# EAGLE design mpr-8x-mux (EAGLE 7.6.0)
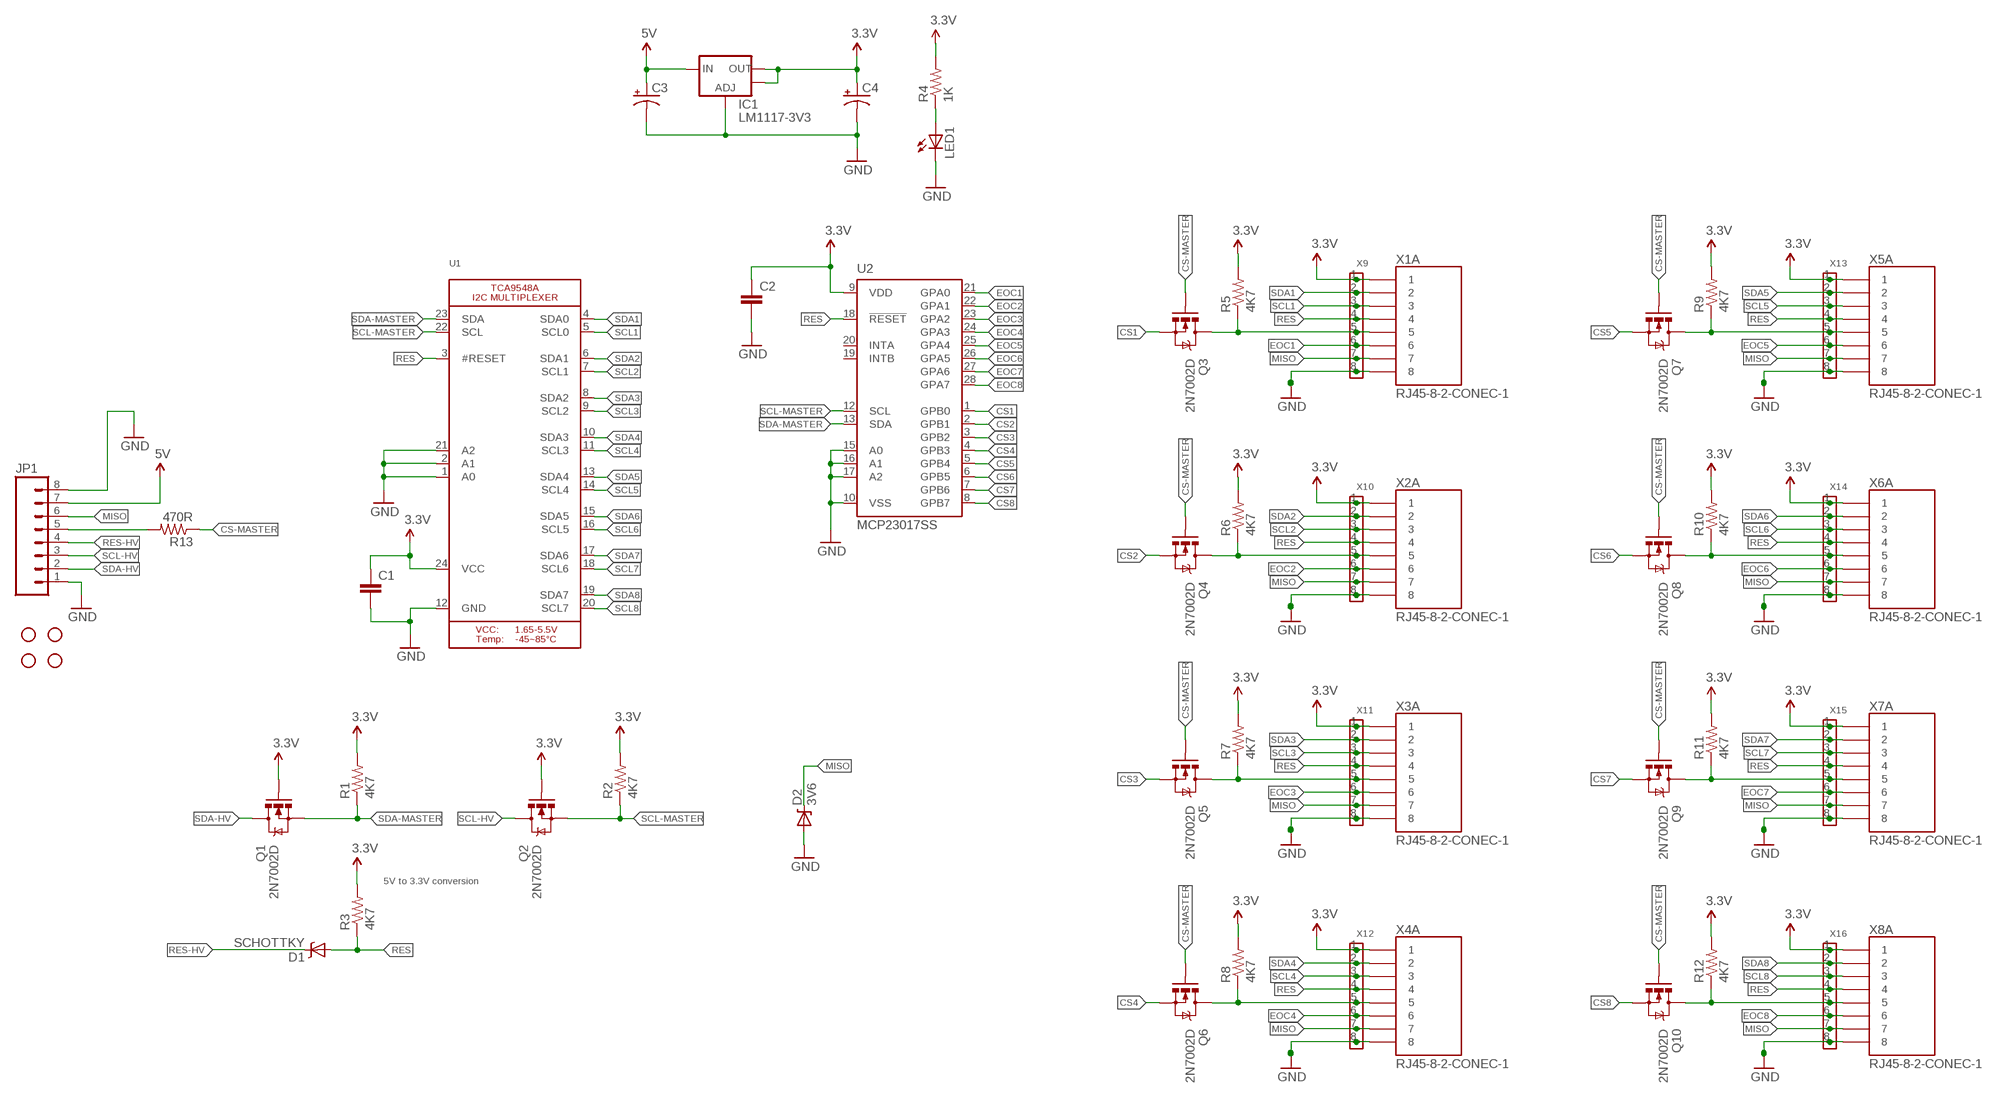
[diagram p0: schematic, sheet 1]

## Parts
C1  CAP0805  [0805]
C2  CAP0805  [0805]
C3  CAP_POL1206-KIT  [EIA3216-KIT]
C4  CAP_POL1206-KIT  [EIA3216-KIT]
D1  SCHOTTKY  DIODE-SCHOTTKYSOD  [SOD-323]
D2  3V6  DIODE-ZENERSOD  [SOD-323]
IC1  LM1117-3V3  V_REG_LM1117SOT223  [SOT223]
JP1  M081X08  [1X08]
JP2  STAND-OFF  [STAND-OFF]
JP3  STAND-OFF  [STAND-OFF]
JP4  STAND-OFF  [STAND-OFF]
JP5  STAND-OFF  [STAND-OFF]
LED1  LED0603  [LED-0603]
Q1  2N7002D  MOSFET-NCHANNELSMD  [SOT23-3]
Q2  2N7002D  MOSFET-NCHANNELSMD  [SOT23-3]
Q3  2N7002D  MOSFET-NCHANNELSMD  [SOT23-3]
Q4  2N7002D  MOSFET-NCHANNELSMD  [SOT23-3]
Q5  2N7002D  MOSFET-NCHANNELSMD  [SOT23-3]
Q6  2N7002D  MOSFET-NCHANNELSMD  [SOT23-3]
Q7  2N7002D  MOSFET-NCHANNELSMD  [SOT23-3]
Q8  2N7002D  MOSFET-NCHANNELSMD  [SOT23-3]
Q9  2N7002D  MOSFET-NCHANNELSMD  [SOT23-3]
Q10  2N7002D  MOSFET-NCHANNELSMD  [SOT23-3]
R1  4K7  RESISTOR0805-RES  [0805]
R2  4K7  RESISTOR0805-RES  [0805]
R3  4K7  RESISTOR0805-RES  [0805]
R4  1K  RESISTOR0805-RES  [0805]
R5  4K7  RESISTOR0805-RES  [0805]
R6  4K7  RESISTOR0805-RES  [0805]
R7  4K7  RESISTOR0805-RES  [0805]
R8  4K7  RESISTOR0805-RES  [0805]
R9  4K7  RESISTOR0805-RES  [0805]
R10  4K7  RESISTOR0805-RES  [0805]
R11  4K7  RESISTOR0805-RES  [0805]
R12  4K7  RESISTOR0805-RES  [0805]
R13  470R  RESISTOR0805-RES  [0805]
U1  TCA9548A  [TSSOP24]
U2  MCP23017SS  [SSOP28]
X1  RJ45-8-2-CONEC-1  [CONEC-33TS3004ST-88001]
X2  RJ45-8-2-CONEC-1  [CONEC-33TS3004ST-88001]
X3  RJ45-8-2-CONEC-1  [CONEC-33TS3004ST-88001]
X4  RJ45-8-2-CONEC-1  [CONEC-33TS3004ST-88001]
X5  RJ45-8-2-CONEC-1  [CONEC-33TS3004ST-88001]
X6  RJ45-8-2-CONEC-1  [CONEC-33TS3004ST-88001]
X7  RJ45-8-2-CONEC-1  [CONEC-33TS3004ST-88001]
X8  RJ45-8-2-CONEC-1  [CONEC-33TS3004ST-88001]
X9  TP-GROUP-X8-2X04  [2X4]
X10  TP-GROUP-X8-2X04  [2X4]
X11  TP-GROUP-X8-2X04  [2X4]
X12  TP-GROUP-X8-2X04  [2X4]
X13  TP-GROUP-X8-2X04  [2X4]
X14  TP-GROUP-X8-2X04  [2X4]
X15  TP-GROUP-X8-2X04  [2X4]
X16  TP-GROUP-X8-2X04  [2X4]

## Nets
3.3V: C1.1 C2.1 C4.A(+) IC1.2(OUT) IC1.4(OUT) Q1.1(G) Q2.1(G) R1.2 R2.2 R3.2 R4.2 R5.2 R6.2 R7.2 R8.2 R9.2 R10.2 R11.2 R12.2 U1.24(VCC) U2.9(VDD) X1.1 X2.1 X3.1 X4.1 X5.1 X6.1 X7.1 X8.1 X9.1 X10.1 X11.1 X12.1 X13.1 X14.1 X15.1 X16.1
5V: C3.A(+) IC1.3(IN) JP1.7
CS1: Q3.2(S) U2.1(GPB0)
CS2: Q4.2(S) U2.2(GPB1)
CS3: Q5.2(S) U2.3(GPB2)
CS4: Q6.2(S) U2.4(GPB3)
CS5: Q7.2(S) U2.5(GPB4)
CS6: Q8.2(S) U2.6(GPB5)
CS7: Q9.2(S) U2.7(GPB6)
CS8: Q10.2(S) U2.8(GPB7)
CS-MASTER: Q3.1(G) Q4.1(G) Q5.1(G) Q6.1(G) Q7.1(G) Q8.1(G) Q9.1(G) Q10.1(G) R13.1
EOC1: U2.21(GPA0) X1.6 X9.6
EOC2: U2.22(GPA1) X2.6 X10.6
EOC3: U2.23(GPA2) X3.6 X11.6
EOC4: U2.24(GPA3) X4.6 X12.6
EOC5: U2.25(GPA4) X5.6 X13.6
EOC6: U2.26(GPA5) X6.6 X14.6
EOC7: U2.27(GPA6) X7.6 X15.6
EOC8: U2.28(GPA7) X8.6 X16.6
GND: C1.2 C2.2 C3.C(-) C4.C(-) D2.2(A) IC1.1(ADJ) JP1.1 JP1.8 LED1.C U1.1(A0) U1.2(A1) U1.12(GND) U1.21(A2) U2.10(VSS) U2.15(A0) U2.16(A1) U2.17(A2) X1.8 X1.M1 X1.M2 X2.8 X2.M1 X2.M2 X3.8 X3.M1 X3.M2 X4.8 X4.M1 X4.M2 X5.8 X5.M1 X5.M2 X6.8 X6.M1 X6.M2 X7.8 X7.M1 X7.M2 X8.8 X8.M1 X8.M2 X9.8 X10.8 X11.8 X12.8 X13.8 X14.8 X15.8 X16.8
MISO: D2.1(C) JP1.6 X1.7 X2.7 X3.7 X4.7 X5.7 X6.7 X7.7 X8.7 X9.7 X10.7 X11.7 X12.7 X13.7 X14.7 X15.7 X16.7
N$1: LED1.A R4.1
N$2: Q7.3(D) R9.1 X5.5 X13.5
N$3: Q8.3(D) R10.1 X6.5 X14.5
N$4: Q9.3(D) R11.1 X7.5 X15.5
N$5: Q10.3(D) R12.1 X8.5 X16.5
N$6: Q6.3(D) R8.1 X4.5 X12.5
N$7: Q5.3(D) R7.1 X3.5 X11.5
N$8: Q4.3(D) R6.1 X2.5 X10.5
N$9: Q3.3(D) R5.1 X1.5 X9.5
N$10: JP1.5 R13.2
RES: D1.2(A) R3.1 U1.3(#RESET) U2.18(!RESET) X1.4 X2.4 X3.4 X4.4 X5.4 X6.4 X7.4 X8.4 X9.4 X10.4 X11.4 X12.4 X13.4 X14.4 X15.4 X16.4
RES-HV: D1.1(C) JP1.4
SCL1: U1.5(SCL0) X1.3 X9.3
SCL2: U1.7(SCL1) X2.3 X10.3
SCL3: U1.9(SCL2) X3.3 X11.3
SCL4: U1.11(SCL3) X4.3 X12.3
SCL5: U1.14(SCL4) X5.3 X13.3
SCL6: U1.16(SCL5) X6.3 X14.3
SCL7: U1.18(SCL6) X7.3 X15.3
SCL8: U1.20(SCL7) X8.3 X16.3
SCL-HV: JP1.3 Q2.3(D)
SCL-MASTER: Q2.2(S) R2.1 U1.22(SCL) U2.12(SCL)
SDA1: U1.4(SDA0) X1.2 X9.2
SDA2: U1.6(SDA1) X2.2 X10.2
SDA3: U1.8(SDA2) X3.2 X11.2
SDA4: U1.10(SDA3) X4.2 X12.2
SDA5: U1.13(SDA4) X5.2 X13.2
SDA6: U1.15(SDA5) X6.2 X14.2
SDA7: U1.17(SDA6) X7.2 X15.2
SDA8: U1.19(SDA7) X8.2 X16.2
SDA-HV: JP1.2 Q1.3(D)
SDA-MASTER: Q1.2(S) R1.1 U1.23(SDA) U2.13(SDA)
Unconnected: U2.19(INTB) U2.20(INTA)

## Notes on the sheet
- 5V to 3.3V conversion

## Library data of the parts
C1 C2 = apollo-ctrl:CAP: Capacitor Standard 0603 ceramic capacitor, and 0.1" leaded capacitor.
C3 C4 = apollo-ctrl:CAP_POL: Capacitor Polarized These are standard SMD and PTH capacitors. Normally 10uF, 47uF, and 100uF in electrolytic and tantalum varieties. Always verify the external diameter of the through hole cap, it varies with capacity, voltage, and manufacturer. The EIA devices should be standard.
D1 = apollo-ctrl:DIODE-SCHOTTKY
D2 = apollo-ctrl:DIODE-ZENER: Zener Diode Production Part - 8199 3.4V Zener Voltage
IC1 = apollo-ctrl:V_REG_LM1117: Voltage Regulator LM1117 Standard adjustable voltage regulator but in SMD form. Spark Fun Electronics SKU : COM-00595
JP1 = apollo-ctrl:M08: Header 8 Standard 8-pin 0.1" header. Use with straight break away headers (SKU : PRT-00116), right angle break away headers (PRT-00553), swiss pins (PRT-00743), machine pins (PRT-00117), and female headers (PRT-00115).
JP2-JP5 = apollo-ctrl:STAND-OFF: Stand Off This is the mechanical footprint for a #4 phillips button head screw. Use the keepout ring to avoid running the screw head into surrounding components. SKU : PRT-00447
LED1 = apollo-ctrl:LED: LEDs Standard schematic elements and footprints for 5mm, 3mm, 1206, and 0603 sized LEDs. 5mm - Spark Fun Electronics SKU : COM-00529 (and others)
Q1-Q10 = apollo-ctrl:MOSFET-NCHANNEL
R1-R13 = apollo-ctrl:RESISTOR: Resistor Basic schematic elements and footprints for 0603, 1206, and PTH resistors.
U1 = apollo-ctrl:TCA9548A: TCA9548A I2C Multiplexer
U2 = apollo-ctrl:MCP23017: http://ww1.microchip.com/downloads/en/DeviceDoc/21952a.pdf Source: http://ww1.microchip.com/downloads/en/DeviceDoc/21952a.pdf; MF: MICROCHIP; MPN: MCP23017-E/SS; OC_FARNELL: 1467674; OC_NEWARK: 31K2960
X1-X8 = apollo-ctrl:RJ45-8-2
X9-X16 = apollo-ctrl:TP-GROUP-X8

## Board
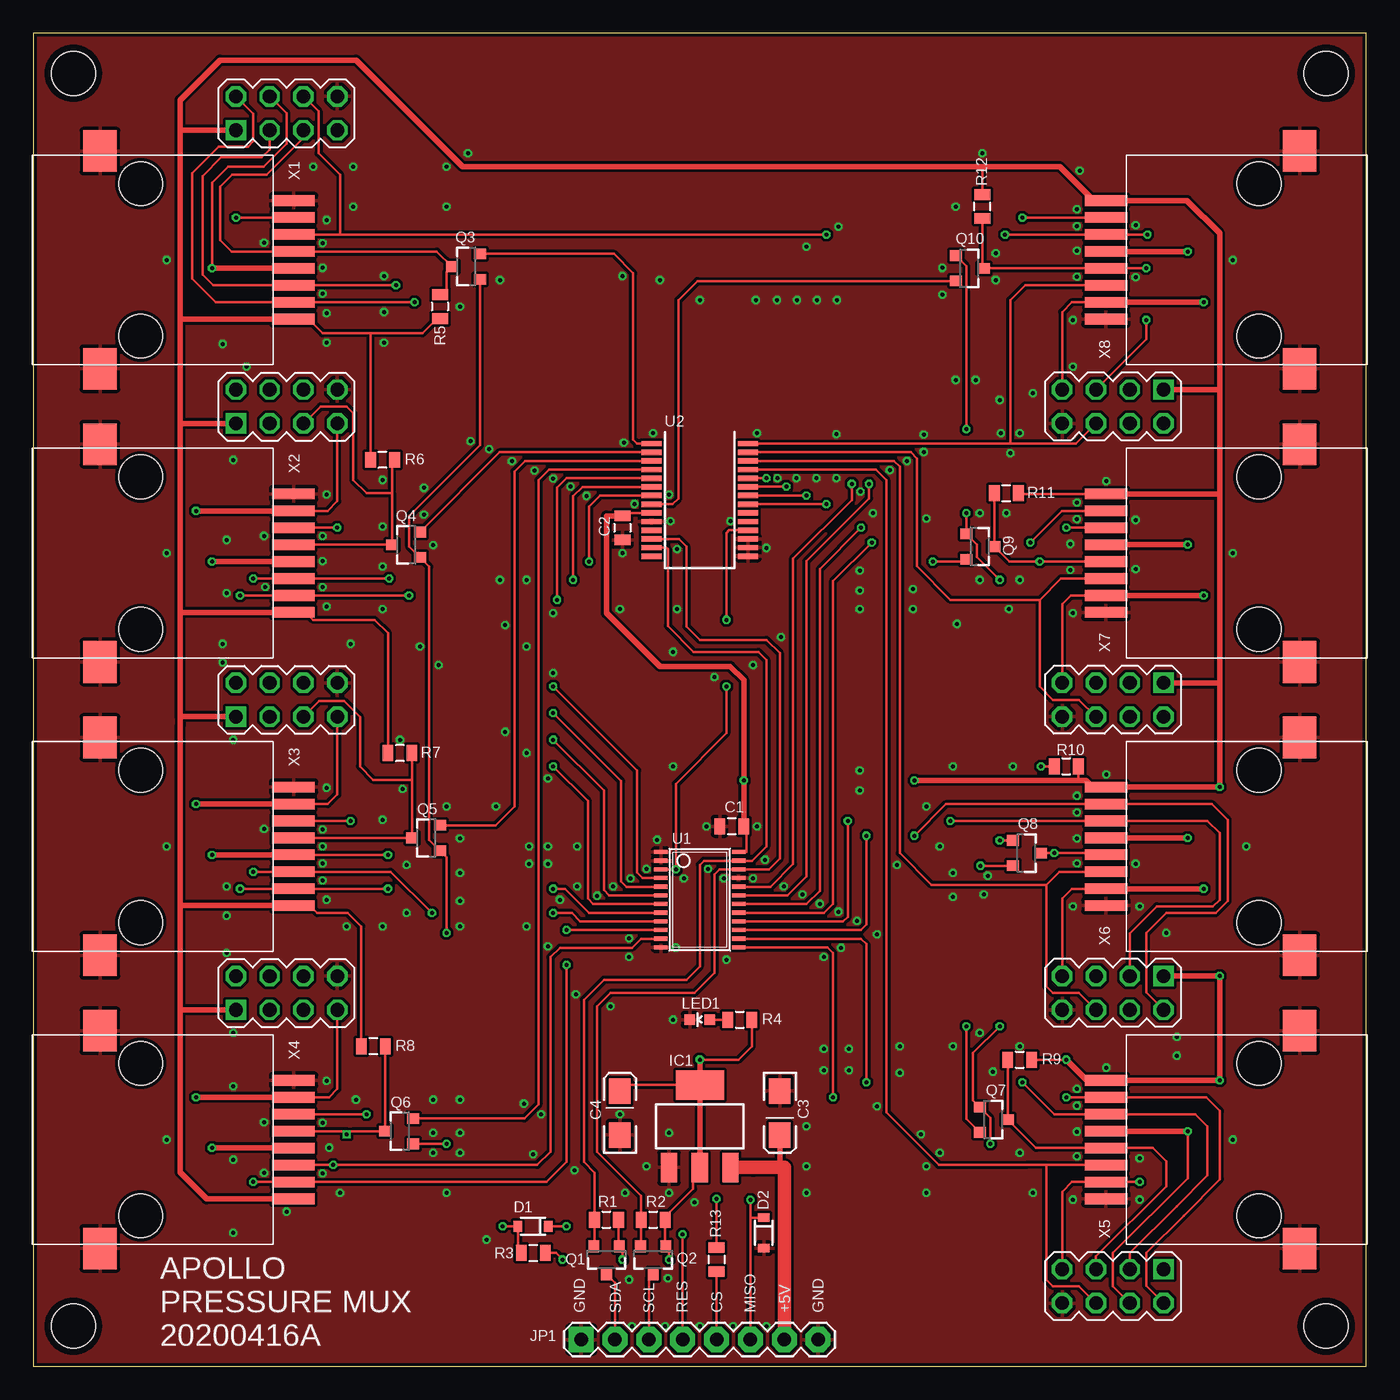
[diagram p1: board, top side]
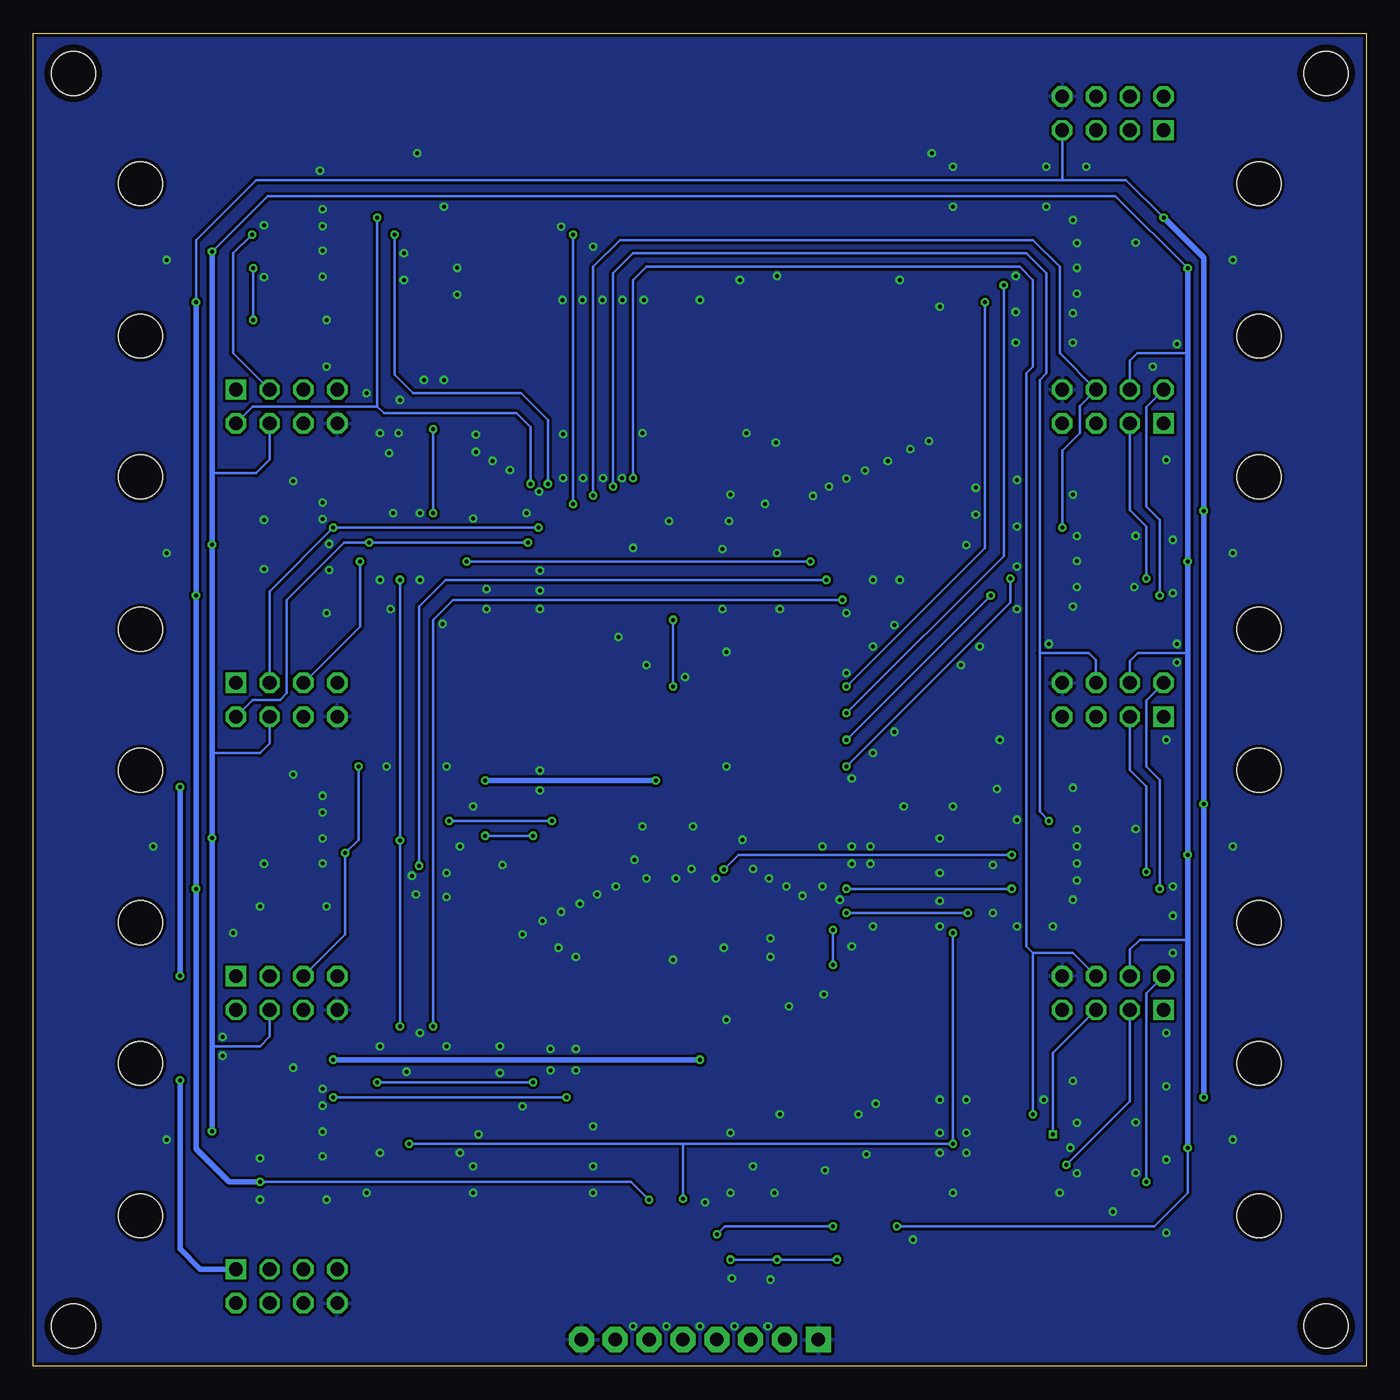
[diagram p2: board, bottom side, seen from below]

Size 100 x 100 mm. Coordinates in mm from the lower left corner, seen from the top.
Outline: 0,0 100,0 100,100 0,100 0,0
Copper layers (1*16): Top 0.035mm / dielectric 1.5mm / Bottom 0.035mm
Design rules "fusion-eagle-rule-tentedvias *": minimum track width 8mil, minimum drill 0.3mm, track to track 8mil, track to pad 8mil, pad to pad 8mil, via to via 8mil, smd to smd 0mil, copper to edge 10mil, drill to drill 10mil, minimum pad ring 10mil, minimum via ring 6mil, stop-mask expansion 2mil, vias tented up to drill 25mil, thermal gap 10mil

### Footprints (pad centres in the part's own frame; a part is rotated, then mirrored left to right if it is on the bottom)
0805 = smd 0.8 x 1.2: 1 -0.9,0; 2 0.9,0
EIA3216-KIT = smd 1.9 x 1.6: A 1.65,0; C -1.65,0
SOD-323 = smd 0.63 x 0.83: 1 -1.15,0; 2 1.15,0
SOT223 = smd 1.219 x 2.235: 1 -2.311,-3.099; 2 0,-3.099; 3 2.311,-3.099 | smd 3.6 x 2.2: 4 0,3.099
1X08 = drill 1.016 pad 1.88 square: 1 0,0 | drill 1.016 pad 1.88 octagon: 2 2.54,0; 3 5.08,0; 4 7.62,0; 5 10.16,0; 6 12.7,0; 7 15.24,0; 8 17.78,0
STAND-OFF = hole 3.302: 0,0
LED-0603 = smd 0.8 x 0.8: A 0,-0.75; C 0,0.75
SOT23-3 = smd 0.8 x 0.9: 1 -0.95,-1; 2 0.95,-1; 3 0,1.1
TSSOP24 = smd 0.305 x 0.991: 1 -3.575,-2.918; 2 -2.925,-2.918; 3 -2.275,-2.918; 4 -1.625,-2.918; 5 -0.975,-2.918; 6 -0.325,-2.918; 7 0.325,-2.918; 8 0.975,-2.918; 9 1.625,-2.918; 10 2.275,-2.918; 11 2.925,-2.918; 12 3.575,-2.918; 13 3.575,2.918; 14 2.925,2.918; 15 2.275,2.918; 16 1.625,2.918; 17 0.975,2.918; 18 0.325,2.918; 19 -0.325,2.918; 20 -0.975,2.918; 21 -1.625,2.918; 22 -2.275,2.918; 23 -2.925,2.918; 24 -3.575,2.918
SSOP28 = smd 0.4 x 1.5: 1 -4.225,-3.625; 2 -3.575,-3.625; 3 -2.925,-3.625; 4 -2.275,-3.625; 5 -1.625,-3.625; 6 -0.975,-3.625; 7 -0.325,-3.625; 8 0.325,-3.625; 9 0.975,-3.625; 10 1.625,-3.625; 11 2.275,-3.625; 12 2.925,-3.625; 13 3.575,-3.625; 14 4.225,-3.625; 15 4.225,3.625; 16 3.575,3.625; 17 2.925,3.625; 18 2.275,3.625; 19 1.625,3.625; 20 0.975,3.625; 21 0.325,3.625; 22 -0.325,3.625; 23 -0.975,3.625; 24 -1.625,3.625; 25 -2.275,3.625; 26 -2.925,3.625; 27 -3.575,3.625; 28 -4.225,3.625
CONEC-33TS3004ST-88001 = smd 0.8 x 3.2: 1 -4.445,-14.52; 2 -3.175,-14.52; 3 -1.905,-14.52; 4 -0.635,-14.52; 5 0.635,-14.52; 6 1.905,-14.52; 7 3.175,-14.52; 8 4.445,-14.52 | smd 3.12 x 2.54: M1 -8.17,0; M2 8.17,0 | hole 3.3: -5.715,-3.05; 5.715,-3.05
2X4 = drill 1.016 square: 1 -3.81,-1.27 | drill 1.016 octagon: 2 -3.81,1.27; 3 -1.27,-1.27; 4 -1.27,1.27; 5 1.27,-1.27; 6 1.27,1.27; 7 3.81,-1.27; 8 3.81,1.27

### Placement (x,y rotation side)
C1  52.4,40.5 180 top
C2  44.2,62.9 270 top
C3  56,19 270 top
C4  44,19 90 top
D1  37.5,10.5 180 top
D2  54.8,10 270 top
IC1  50,18 0 top
JP1  41.1,2 0 top
JP2  3,3 0 top
JP3  97,3 0 top
JP4  3,97 0 top
JP5  97,97 0 top
LED1  50,26 90 top
Q1  43,8 180 top
Q2  46.5,8 180 top
Q3  32.5,82.5 90 top
Q4  28,61.63 90 top
Q5  29.5,39.63 90 top
Q6  27.5,17.64 90 top
Q7  72,18.5 270 top
Q8  74.5,38.5 270 top
Q9  71,61.5 270 top
Q10  70.2,82.36 270 top
R1  43,11 0 top
R2  46.5,11 0 top
R3  37.5,8.5 0 top
R4  53,26 0 top
R5  30.5,79.5 270 top
R6  26.2,68 180 top
R7  27.5,46 180 top
R8  25.5,24 180 top
R9  74,23 0 top
R10  77.5,45 0 top
R11  73,65.5 0 top
R12  71.2,87 90 top
R13  51.26,8 270 top
U1  50,35 270 top
U2  50,65 270 top
X1  5,83 90 top
X2  5,61 90 top
X3  5,39 90 top
X4  5,17 90 top
X5  95,17 270 top
X6  95,39 270 top
X7  95,61 270 top
X8  95,83 270 top
X9  19,94 0 top
X10  19,72 0 top
X11  19,50 0 top
X12  19,28 0 top
X13  81,6 180 top
X14  81,28 180 top
X15  81,50 180 top
X16  81,72 180 top

### Tracks (layer width: path | path; a pad name or v marks a point on that pad's centre or on a via)
3.3V  (via drill 0.3)
  Top 0.203: U2.9 44.2,64.03 C2.1 | U1.24 53.5,38.58 53.5,40.5 | IC1.4 44,21.1 C4.A | IC1.2 49.5,14.9 49.5,13.3 47.4,11.2 R2.2 47.4,9 Q2.1 47.7,9 v47.7,8 | R1.2 43.9,9 Q1.1 44.2,9 v44.2,8 | R3.2 39.2,8.5 v39.7,8 | v50,23 52.9,23 53.9,24 R4.2 | R9.2 v77.5,23 | R10.2 78.4,43.95 78,43.95 | X7.1 73.9,65.44 R11.2 | R12.2 71.2,90 32.2,90 | 11,24 11,25 | 11,46 11,47 | 11,68 11,69.5 | 25.3,77.5 29.2,77.5 30.3,78.6 R5.2 | 25.3,77.5 21.7,77.5 20.64,78.56 X1.1 | 89,73.27 89,74.5 | 89,51.27 89,51 | R8.2 24.6,32.99 23.59,34 21.3,34 20.75,34.55 X3.1 | 11,26.73 11,26.5 | R7.2 26.6,54.99 25.59,56 21,56 20.45,56.55 X2.1 | R6.2 25.3,77.5
  Top 0.406: X3.1 11,34.55 | 11,34.55 11,47 11,48 11,48.73 | 11,48.73 11,56.55 | 11,56.55 11,69.5 11,70.73 | 11,70.73 11,78.56 | 11,78.56 X1.1 | X2.1 11,56.55 | X4.1 13,12.55 11,14.56 11,25 11,26.5 11,34.55 | 89,65.44 89,51 v89,43.45 X6.1 79.45,43.45 78.95,43.95 78,43.95 v66.1,43.95 | 89,65.44 89,74.5 89,85 86.56,87.44 X8.1 79.56,87.44 77,90 32.2,90 24.2,98 14,98 11,95 11,92.73 | X7.1 89,65.44 | C2.1 43,63.8 43,56.5 47,52.5 52.28,52.5 53.3,51.48 v53.3,43.95 C1.1 53.5,40.5 | 11,78.56 11,92.73 | v50,23 IC1.4 IC1.2 | v77.5,23 79.06,21.45 X5.1 v89,21.45 v89,29.27 X14.1 | X16.1 89,73.27 | X15.1 89,51.27 | X12.1 11,26.73 | X9.1 11,92.73 | X10.1 11,70.73 | X11.1 11,48.73
  Bottom 0.203: v47.7,8 v44.2,8 v39.7,8
  Bottom 0.406: v66.1,43.95 v53.3,43.95 | v77.5,23 v50,23 | v89,43.45 v89,29.27 | X13.1 87.48,7.27 89,8.79 v89,21.45
5V
  Top 0.406: C3.A 56,14.9 54,14.9
  Top 1.016: JP1.7 56.34,14.9 54,14.9 IC1.3
CS1
  Top 0.203: U2.1 45.3,69.22 45,69.53 45,82 43.55,83.45 Q3.2
CS2
  Top 0.203: U2.2 34.99,68.58 Q4.2
CS3
  Top 0.203: U2.3 36.9,67.92 36.1,67.12 36.1,42 34.68,40.59 Q5.2
CS4
  Top 0.203: U2.4 38.7,67.28 37.9,66.47 37.9,19.64 36.85,18.59 Q6.2
CS5  (via drill 0.3)
  Top 0.203: U2.5 40,66.62 39.3,65.92 v39.3,57.5 | Q7.2 70,18.55 v70,25.5
  Bottom 0.203: v70,25.5 70,56 68.5,57.5 v39.3,57.5
CS6  (via drill 0.3)
  Top 0.203: U2.6 41.2,65.97 40.5,65.27 v40.5,59 | v71.06,37.55 Q8.2
  Bottom 0.203: v71.06,37.55 71.06,57 69.06,59 v40.5,59
CS7  (via drill 0.3)
  Top 0.203: U2.7 42.52,65.33 41.7,64.51 v41.7,60.37 | v67.48,60.37 70,60.37 Q9.2
  Bottom 0.203: v41.7,60.37 v67.48,60.37
CS8
  Top 0.203: U2.8 47.96,64.67 48.4,65.11 48.4,80 49.82,81.42 Q10.2
CS-MASTER  (via drill 0.3)
  Top 0.203: v72.5,25.5 70.5,23.5 70.5,19.95 Q7.1 71.8,18.65 v71.8,16.68 | v72.5,59 70.8,60.7 70.8,61.65 Q9.1 v70,64 | v70,70.3 70,82.52 Q10.1 | v31,32.5 31,38.19 Q5.1 29.7,39.48 29.7,59.98 Q4.1 28.2,61.48 28.2,63.8 33.5,69.1 Q3.1 | Q8.1 v72.5,39.45 | Q6.1 v31,16.68 | R13.1 v51.26,12.54
  Bottom 0.203: v70,64 v70,70.3 | v31,32.5 v31,16.68 51.26,16.68 | v51.26,12.54 51.26,16.68 | 51.26,16.68 v71.8,16.68 | v72.5,25.5 v72.5,39.45 v72.5,59
EOC1  (via drill 0.3)
  Top 0.203: U2.21 v59.5,64.67 | v59.5,84.91 23,84.91 | 23,84.91 X1.6 | X9.6 21.4,94.14 21.4,91 23,89.4 23,84.91
  Bottom 0.203: v59.5,64.67 v59.5,84.91
EOC2  (via drill 0.3)
  Top 0.203: U2.22 v58,65.33 | v22.8,62.91 X2.6
  Bottom 0.203: v58,65.33 58,82.5 56,84.5 25,84.5 23,82.5 23,76 X10.6 21.5,72.04 21.5,70 22.8,68.7 v22.8,62.91
EOC3  (via drill 0.3)
  Top 0.203: U2.23 53.62,66 v56.5,66 | v23.8,40.91 X3.6
  Bottom 0.203: v56.5,66 56.5,82 55,83.5 25.5,83.5 24,82 24,74.5 24.5,74 24.5,53.5 | 24.5,53.5 24.5,41.6 v23.8,40.91 | X11.6 20.27,52.97 20.8,53.5 24.5,53.5
EOC4  (via drill 0.3)
  Top 0.203: U2.24 v55,66.62 | v25,18.91 X4.6
  Bottom 0.203: v55,66.62 55,81.5 54,82.5 26,82.5 25,81.5 25,75 25.5,74.5 25.5,31.5 25,31 | 25,31 v25,18.91 | X12.6 22,31 25,31
EOC5
  Top 0.203: U2.25 63.23,67.28 64,66.5 64,19.03 67.94,15.1 74.5,15.1 76,15.1 | 76,15.1 X5.6 | X13.6 78.46,6 76.5,6 76,6.5 76,15.1
EOC6
  Top 0.203: U2.26 64.58,67.92 65,67.5 65,38.5 67.39,36.11 76,36.11 | X6.6 76.98,37.09 76,36.11 | X14.6 78.46,28 76.5,28 76,28.5 76,36.11
EOC7
  Top 0.203: U2.27 65.83,68.58 66.3,68.1 66.3,60.02 68.82,57.5 75.5,57.5 | X7.6 77.09,59.09 75.5,57.5 | X15.6 78.46,50 76.5,50 75.5,51 75.5,57.5
EOC8
  Top 0.203: U2.28 73.3,69.22 | 73.3,69.22 73.3,79.98 74.41,81.09 X8.6 | X16.6 78.22,69.22 73.3,69.22
GND  (via drill 0.3)
  other vias: 47.7,13 47.7,17.5 44,18.9 48.2,31.4 50.5,40.5 44.2,61 47.8,63.4 22,86 22,65.4 22,43.4 22,21.4 78,12.5 78,34.5 78,56.5 78,78.5 55.82,66.62 57.25,66.62 58.75,66.62 60.25,66.62 54.3,40.5 48.3,56.8 54.9,38 54,36.6 56.3,36 57.7,35.4 62.05,65.62 59,34.7 60.4,34.1 61.8,33.4 64.25,67.22 51.8,36.6 65.55,67.92 45.1,64.7 52.3,63.4 46,37.3 44.8,36.6 43.5,36 42.3,35.3 44.7,32.1 50.62,37.3 19,11.6 41.5,65.3 40.3,66 39,66.6 37.6,67.2 63,64 35.9,67.9 34.2,68.8 38.6,31.5 38.1,18.9 22.2,16.4 21.7,60.4 21.7,82.4 48.8,36.6 39.5,35 40.8,36 40.8,39 38.6,39 37.2,39 37.2,37.7 38.6,37.7 34.7,42 28,37.6 35,59 37,59 48,53.6 54,52.6 56.1,54.7 55,61.4 62,56.8 62,58.2 62,59.7 66,58.3 67,63.6 77.8,61.7 78.3,39.6 78.3,17.6 54.3,70 72.6,70 74,70 60.4,85.5 78.3,83.7 17.3,84.3 17.3,62.3 17.3,40.3 17.3,18.3 17.3,14.5 83,15.6 82.7,37.7 82.7,59.8 82.7,63.5 82.7,81.7 82.7,85.6 58,84 26.3,79.1 26.3,81.8 66,56.8 73.2,56.8 62,44.7 62,43.2 67,42 68,39 63.3,32.4 61.2,23.8 61.2,22.2 63.3,19.5 36.8,19.7 40.6,14.7 44.4,13 44.9,3 47.4,3 50,3 52.5,3 55,3 48.3,61.3 39,52 39,56.5 46.8,39.5 51.1,51.7 46.5,70 47.7,65.4 60.25,69.92 28,34 26.2,41 23,13 21.7,14.46 21.7,18.27 21.7,36.46 21.7,40.27 21.7,37.73 21.7,39 21.7,58.46 21.7,62.27 21.7,84.27 21.7,80.46 78.3,15.73 78.3,19.55 78.3,20.8 78.3,42.8 78.3,64.8 78.3,86.8 78.3,37.73 77.8,59.73 78.3,81.73 78.3,63.54 80.5,44.4 80.5,22.4 80.5,66.4 78.5,89.7 22,35 22,57 22,79 43.3,27 66.6,17.4 26.2,60 49.6,12.3 47.6,6.6 44.7,6.5 59.3,23.8 59.3,22.2 59.3,30.7 60.6,31.4 78.3,41.55 29.3,63.9 32,17.5 30,17.5 30,16 32,16 46,15 68,16 74,24 67,15 67,13 65,24 65,22 50,80 47,81.5 44.2,81.8 32,79.5 26.3,76.8 22,76.8 26.2,66.5 29.3,65.9 30,61.6 27.5,47 31,42 32,39.6 32,37 32,34.9 32,33 30,20 32,20 31,13 37.5,15.9 74,16 72,22.1 71,25 71.3,35.4 71.6,36.8 69,37 69,35.2 64.8,37.6 69,45 73.5,45 71,59 74,59 69.3,55.7 66.8,68.6 66.8,69.9 69.2,74 70.7,74 78,75 72.2,83.5 72.2,81.5 71.2,91 69.2,87 68.2,82.4 68.2,80.4 60.3,80 55.8,80 57.3,80 58.8,80 54.2,80 44.3,69.3 32.8,69.4 26.2,63 26.2,56.8 29,54 30.4,52.6 35.4,55.6 35.4,47.6 38.6,44.1 37,46 37,54 44,56.8 37,33 69,24 44.7,30.7 40.7,27.9 48,26 52,30.5 58,15 58,13 58,18 34,9.5 73,64 71,64 73.3,68.5 75,73 72.5,72.5 16,75 15,68 14.5,62 14.5,58 17.4,58.46 14.2,54.2 14.2,52.8 14.5,36 14.5,33.8 14.5,31 15,25 15,21 15,15.5 24.2,20 23.5,33 26.2,33 23.8,54.2 27.7,43.3 15,47 14.2,76.7 24,90 21,90 24,87 32.6,91 31,90 31,87 35,81.5 78.3,85.54 85,32.5 83,34.5 85.8,23.3 85.8,24.7 75,13 83,12.5 48,45 15,10 10,17 10,39 10,61 10,83 90,83 90,61 91,39 90,17
  pour Top (isolate 0.203): 0,0 100,0 100,100 0,100
  pour Bottom (isolate 0.203): 0,0 100,0 100,100 0,100
MISO  (via drill 0.3)
  Top 0.203: JP1.6 v53.8,12.48 | 53.8,12.15 v53.8,12.48 | D2.1 53.8,11.15 v53.8,12.48 | X8.7 77.92,79.83 77.19,79.1 X16.7 | X15.7 77.19,57.17 77.85,57.83 X7.7 | X14.7 77.19,35.09 77.92,35.83 X6.7 | v83,13.82 X5.7 77.92,13.82 77.19,13.1 X13.7 | X12.7 22.81,20.79 22.2,20.18 X4.7 | X11.7 22.81,42.89 22.1,42.17 X3.7 | X2.7 22.1,64.17 22.81,64.89 X10.7 | X1.7 v15.2,86.17
  Top 0.406: X4.7 v12.2,20.18 | X3.7 v12.2,42.17 | X2.7 v12.2,64.17 | v87.8,79.83 X8.7 | X6.7 v87.8,35.83 | X7.7 v87.8,57.83
  Bottom 0.203: v53.8,12.48 55.14,13.82 v83,13.82 | v87.8,79.83 87.8,84.5 83.3,89 22.81,89 | 22.81,89 18.02,89 v15.2,86.17 | X9.7 22.81,89
  Bottom 0.406: v12.2,20.18 v12.2,42.17 v12.2,64.17 12.2,83.17 v15.2,86.17 | v87.8,79.83 v87.8,57.83 v87.8,35.83 87.8,16.32 85.3,13.82 v83,13.82
N$1
  Top 0.203: R4.1 LED1.A
N$2
  Top 0.203: R9.1 Q7.3 75.23,16.36 X5.5 83.99,16.36 85,15.36 85,13.5 79.73,8.23 X13.5
N$3  (via drill 0.3)
  Top 0.203: X6.5 80.48,38.5 v76.6,38.5 Q8.3 | R10.1 v75.6,45
  Bottom 0.203: v75.6,45 75.6,39.5 v76.6,38.5 76.6,32.4 X14.5
N$4  (via drill 0.3)
  Top 0.203: R11.1 Q9.3 73.23,60.37 v75.5,60.37 X7.5
  Bottom 0.203: v75.5,60.37 75.5,55.5 X15.5
N$5  (via drill 0.3)
  Top 0.203: R12.1 71.2,82.36 Q10.3 X8.5 v83.5,82.36 | X16.5 83.5,77.04 v83.5,78.5
  Bottom 0.203: v83.5,78.5 v83.5,82.36
N$6  (via drill 0.3)
  Top 0.203: R8.1 Q6.3 24,17.64 23.5,17.64 | 23.5,17.64 X4.5 | v23.5,17.4 23.5,17.64
  Bottom 0.203: X12.5 23.5,23.5 v23.5,17.4
N$7
  Top 0.203: X3.5 Q5.3 28.4,44 | R7.1 28.4,44 | X11.5 21.44,49.9 23.3,49.9 24.5,48.7 24.5,45 25.5,44 28.4,44
N$8
  Top 0.203: 26.9,65.5 Q4.3 X2.5 | X10.5 21.54,72 23.5,72 24,71.5 24,66.5 25,65.5 26.9,65.5 | 26.9,65.5 26.9,68 R6.1
N$9
  Top 0.203: R5.1 31,80.4 31,82.1 Q3.3 30.27,83.64 X1.5 14.87,83.64 14,84.5 14,88.5 14.9,89.4 17.5,89.4 20.27,92.17 X9.5
N$10
  Top 0.203: JP1.5 R13.2
RES  (via drill 0.3)
  Top 0.203: U2.18 52.2,62.73 52,62.52 v52,56 | v52,51 52,47.5 48.2,43.7 v48.2,37.27 U1.3 | v26.6,38.37 X3.4 | R3.1 36.35,8.55 D1.2 v35.22,10.5 | X13.4 81,6 81,8.5 86.6,14.1 v86.6,17.64 | X9.4 19,94 19,91.71 17.29,90 14.6,90 13.4,88.8 v13.4,82.36
  Top 0.406: X5.4 v86.6,17.64 | X7.4 v86.6,61.63 | X6.4 v86.6,39.63 | X4.4 v13.4,16.36 | X2.4 v13.4,60.37 | X8.4 v86.6,83.64 | X3.4 v13.4,38.37 | X1.4 v13.4,82.36
  Bottom 0.203: v26.6,38.37 47.11,38.37 v48.2,37.27 | v52,56 v52,51 | v13.4,16.36 13.4,13 15.9,10.5 v35.22,10.5 | v86.6,83.64 82.44,87.8 18.84,87.8 v13.4,82.36 | X16.4 82.27,68.03 83.3,67 86.6,67 | X15.4 82.27,46.73 83,46 86.6,46 | X14.4 82.27,24.73 83,24 86.6,24 | X12.4 17.73,31.27 17,32 13.4,32 | X11.4 17.73,52.9 17.13,53.5 13.4,53.5 | X10.4 17.73,75.45 17.18,76 13.4,76
  Bottom 0.406: v86.6,17.64 86.6,24 v86.6,39.63 86.6,46 v86.6,61.63 86.6,67 v86.6,83.64 | v13.4,16.36 13.4,32 v13.4,38.37 13.4,53.5 v13.4,60.37 13.4,76 v13.4,82.36
RES-HV  (via drill 0.3)
  Top 0.203: v48.72,9.9 JP1.4 | D1.1 v40,10.5
  Bottom 0.203: v40,10.5 48.12,10.5 v48.72,9.9
SCL1  (via drill 0.3)
  Top 0.203: U1.5 44.5,35.98 44.1,36.38 44.1,43.9 v39,49 | v27.2,81.09 X1.3 13.51,81.09 12.7,81.9 12.7,89.3 14.1,90.7 17.14,90.7 17.73,91.29 X9.3
  Bottom 0.203: v27.2,81.09 27.2,60.8 v39,49
SCL2  (via drill 0.3)
  Top 0.203: U1.7 42,34.67 41.6,35.08 41.6,42.4 v39,45 | v26.7,59.09 X2.3 v16.5,59.09
  Bottom 0.203: v26.7,59.09 26.7,57.3 v39,45 | v16.5,59.09 16.5,63 17.73,64.23 X10.3
SCL3  (via drill 0.3)
  Top 0.203: U1.9 41.02,33.38 40.4,34 v39,34 | v29.9,34 26.8,37.09 X3.3 v16.5,37.09
  Bottom 0.203: v29.9,34 v39,34 | v16.5,37.09 16.5,43.5 17.73,44.73 X11.3
SCL4  (via drill 0.3)
  Top 0.203: U1.11 45.58,32.08 44.9,31.4 39.5,31.4 38.8,30.7 38.8,16.09 37.8,15.1 v22.5,15.1 X4.3
  Bottom 0.203: X12.3 17.73,19.86 v22.5,15.1
SCL5  (via drill 0.3)
  Top 0.203: U1.14 62.1,32.08 62.5,31.67 v62.5,21.3 | v74.2,21.3 76.59,18.91 X5.3 87.19,18.91 88.09,18 88.09,14.32 85.78,12 82.27,8.49 X13.3
  Bottom 0.203: v74.2,21.3 v62.5,21.3
SCL6  (via drill 0.3)
  Top 0.203: U1.16 60.76,33.38 61.1,33.72 v61.1,40.91 | v68.8,40.91 X6.3 88.09,40.91 89,40 89,35 88.5,34.5 84.28,34.5 82.27,32.49 X14.3
  Bottom 0.203: v61.1,40.91 v68.8,40.91
SCL7  (via drill 0.3)
  Top 0.203: v77.5,62.91 X7.3 | U1.18 58,34.67 59,35.67 59,59.8 v62.1,62.91
  Bottom 0.203: v62.1,62.91 v77.5,62.91 82.27,58.13 X15.3
SCL8  (via drill 0.3)
  Top 0.203: U1.20 55.3,35.98 57,37.67 57,60.6 61.4,65 v61.4,66.2 | v72.9,84.91 X8.3 v83.59,84.91
  Bottom 0.203: v61.4,66.2 61.4,71 63.4,73 71.5,73 72.9,74.4 v72.9,84.91 | X16.3 85,76 85,83.5 v83.59,84.91
SCL-HV
  Top 0.203: JP1.3 46.18,6.58 Q2.3
SCL-MASTER
  Top 0.203: U2.12 48.42,62.08 49,61.5 49,55.5 50,54.5 55,54.5 56,53.5 56,38.1 55.17,37.27 U1.22 51.48,37.27 51.1,36.9 51.1,29.5 49.6,28 43.32,28 42.3,26.98 42.3,16.09 45.6,12.79 R2.1 45.6,9 Q2.2
SDA1  (via drill 0.3)
  Top 0.203: U1.4 45.72,36.62 45.3,37.04 45.3,44.7 v39,51 | v28.6,79.83 X1.2 13.68,79.83 11.9,81.6 11.9,89.5 13.9,91.5 16.1,91.5 16.5,91.9 16.5,93.96 X9.2
  Bottom 0.203: v28.6,79.83 28.6,61.4 v39,51
SDA2  (via drill 0.3)
  Top 0.203: U1.6 43.2,35.33 42.8,35.73 42.8,43.2 v39,47 | v28.18,57.83 X2.2 v15.5,57.83
  Bottom 0.203: v39,47 v28.18,57.83 | v15.5,57.83 15.5,63.5 16.5,64.5 16.5,71.96 X10.2
SDA3  (via drill 0.3)
  Top 0.203: U1.8 41.67,34.02 39.88,35.83 v39,35.83 | v26.6,35.83 X3.2 v15.5,35.83
  Bottom 0.203: v39,35.83 v26.6,35.83 | X11.2 16.5,49.96 16.5,45 15.5,44 v15.5,35.83
SDA4  (via drill 0.3)
  Top 0.203: v40,30.1 40,15.34 38.49,13.82 X4.2 v16.5,13.82 | v40,32.73 U1.10
  Bottom 0.203: v40,30.1 v40,32.73 | v16.5,13.82 16.5,27.96 X12.2
SDA5  (via drill 0.3)
  Top 0.203: U1.13 59.58,31.43 60,31 v60,20.18 | v77.5,20.18 X5.2 88,20.18 89.02,19.16 89.02,14.02 86.3,11.3 83.5,8.5 83.5,6.04 X13.2
  Bottom 0.203: v77.5,20.18 v60,20.18
SDA6  (via drill 0.3)
  Top 0.203: U1.15 62.1,32.73 62.5,33.13 v62.5,39.8 | v66.1,39.8 68.47,42.17 X6.2 88.42,42.17 89.6,41 89.6,34.9 88.7,34 85,34 83.5,32.5 83.5,28.04 X14.2
  Bottom 0.203: v66.1,39.8 v62.5,39.8
SDA7  (via drill 0.3)
  Top 0.203: X7.2 77.17,64.17 v74.8,61.8 | U1.17 59.33,34.02 60,34.7 60,58.9 v62.9,61.8
  Bottom 0.203: v62.9,61.8 v74.8,61.8 76.7,61.8 81,57.5 81,50.5 81.5,50 83.54,50 X15.2
SDA8  (via drill 0.3)
  Top 0.203: U1.19 56.6,35.33 58,36.73 58,60.4 62.7,65.1 v62.7,66.2 | v74.2,86.17 X8.2
  Bottom 0.203: v62.7,66.2 62.7,70.46 63.74,71.5 73.7,71.5 74.2,72 | 74.2,72 v74.2,86.17 | X16.2 83.54,72 74.2,72
SDA-HV
  Top 0.203: JP1.2 43.64,6.26 Q1.3
SDA-MASTER
  Top 0.203: U2.13 47.48,61.42 47.6,61.3 47.6,55.54 49.54,53.6 54.4,53.6 55,53 55,39 53.92,37.92 U1.23 50.3,37.92 50,37.62 50,30 49,29 42.81,29 41.3,27.49 41.3,15.32 42.1,14.53 R1.1 42.1,9 Q1.2

### Text on the board
tPlace: GND | SDA | SCL | RES | CS | MISO | +5V | GND | APOLLO / PRESSURE MUX / 20200416A